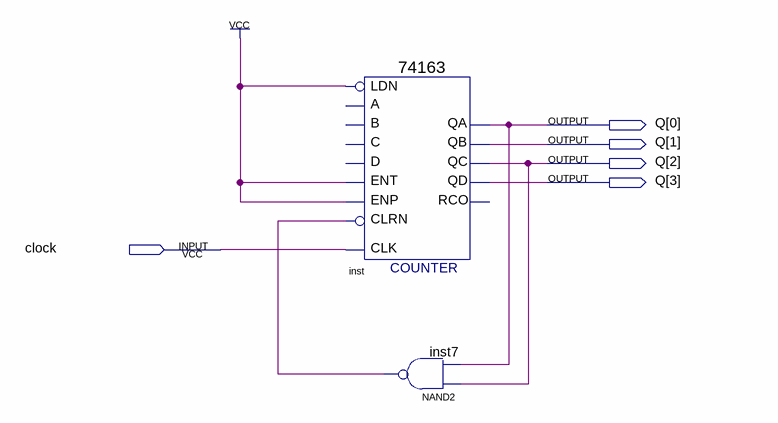
[diagram p0: schematic sheet]
// Quartus schematic Q3.bdf as structural Verilog: 2 symbols, 5 pins
module Q3 (
  input  clock,
  output [3:0] Q
);

  wire inst7_out;

  \74163  inst (
    .ENT(1'b1), .CLRN(inst7_out), .CLK(clock), .ENP(1'b1), .LDN(1'b1), .QA(Q[0]), .QB(Q[1]), .QC(Q[2]),
    .QD(Q[3]));  // open: C, B, A, D, RCO
  nand inst7 (inst7_out, Q[2], Q[0]);
endmodule
